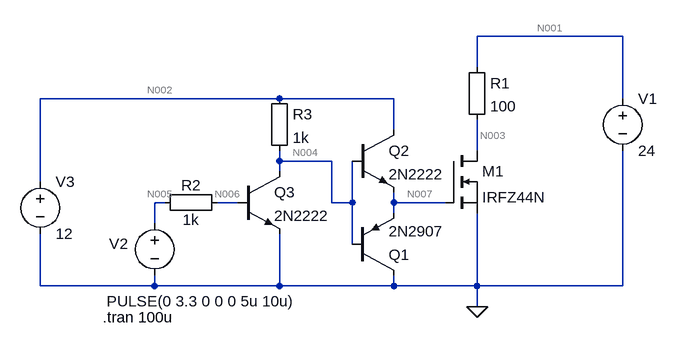
[diagram p0: schematic Drive3.asc]
Drive3.asc, the LTspice schematic file:
Version 4
SHEET 1 880 680
WIRE 464 -96 240 -96
WIRE 240 -48 240 -96
WIRE -64 0 -432 0
WIRE 112 0 -64 0
WIRE 464 0 464 -96
WIRE 112 48 112 0
WIRE 240 80 240 32
WIRE -64 96 -64 80
WIRE 16 96 -64 96
WIRE -64 112 -64 96
WIRE -432 128 -432 0
WIRE -240 160 -256 160
WIRE -128 160 -160 160
WIRE 16 160 16 96
WIRE 48 160 48 96
WIRE 48 160 16 160
WIRE 112 160 112 144
WIRE 192 160 112 160
WIRE 112 176 112 160
WIRE -256 192 -256 160
WIRE 48 224 48 160
WIRE -432 288 -432 208
WIRE -256 288 -256 272
WIRE -256 288 -432 288
WIRE -64 288 -64 208
WIRE -64 288 -256 288
WIRE 112 288 112 272
WIRE 112 288 -64 288
WIRE 240 288 240 176
WIRE 240 288 112 288
WIRE 464 288 464 80
WIRE 464 288 240 288
WIRE 240 320 240 288
FLAG 240 320 0
SYMBOL nmos 192 80 R0
SYMATTR InstName M1
SYMATTR Value IRFZ44N
SYMBOL voltage 464 -16 R0
WINDOW 123 0 0 Left 0
WINDOW 39 0 0 Left 0
SYMATTR InstName V1
SYMATTR Value 24
SYMBOL Misc\\EuropeanResistor 224 -64 R0
SYMATTR InstName R1
SYMATTR Value 100
SYMBOL Misc\\EuropeanResistor -256 176 R270
WINDOW 0 27 56 VTop 2
WINDOW 3 5 56 VBottom 2
SYMATTR InstName R2
SYMATTR Value 1k
SYMBOL voltage -256 176 R0
WINDOW 3 -74 136 Left 2
WINDOW 123 0 0 Left 0
WINDOW 39 0 0 Left 0
WINDOW 0 -70 47 Left 2
SYMATTR Value PULSE(0 3.3 0 0 0 5u 10u)
SYMATTR InstName V2
SYMBOL pnp 48 272 M180
SYMATTR InstName Q1
SYMATTR Value 2N2907
SYMBOL npn 48 48 R0
SYMATTR InstName Q2
SYMATTR Value 2N2222
SYMBOL voltage -432 112 R0
WINDOW 123 0 0 Left 0
WINDOW 39 0 0 Left 0
SYMATTR InstName V3
SYMATTR Value 12
SYMBOL Misc\\EuropeanResistor -80 -16 R0
SYMATTR InstName R3
SYMATTR Value 1k
SYMBOL npn -128 112 R0
SYMATTR InstName Q3
SYMATTR Value 2N2222
TEXT -336 336 Left 2 !.tran 100u

The netlist it stands for:
* Drive3.asc
M1 N003 N007 0 0 IRFZ44N
V1 N001 0 24
R1 N001 N003 100
R2 N005 N006 1k
V2 N005 0 PULSE(0 3.3 0 0 0 5u 10u)
Q1 0 N004 N007 0 2N2907
Q2 N002 N004 N007 0 2N2222
V3 N002 0 12
R3 N002 N004 1k
Q3 N004 N006 0 0 2N2222
.model NPN NPN
.model PNP PNP
.lib standard.bjt
.model NMOS NMOS
.model PMOS PMOS
.lib standard.mos
.tran 100u
.backanno
.end

* Results of the author's LTspice run, read from the files saved beside the schematic
* Operating Point, zero values left out:
*   V(n003) = 2.778 mV
*   V(n007) = 12 V
*   V(n001) = 24 V
*   V(n004) = 12 V
*   V(n002) = 12 V
*   Ic(Q3) = 12.01 pA
*   Ib(Q3) = -12 pA
*   Ic(Q1) = -12.02 pA
*   Ib(Q1) = 12 pA
*   Id(M1) = 240 mA
*   Is(M1) = -240 mA
*   I(R3) = 24.01 pA
*   I(R2) = -12 pA
*   I(R1) = 240 mA
*   I(V3) = -24.02 pA
*   I(V2) = 12 pA
*   I(V1) = -240 mA
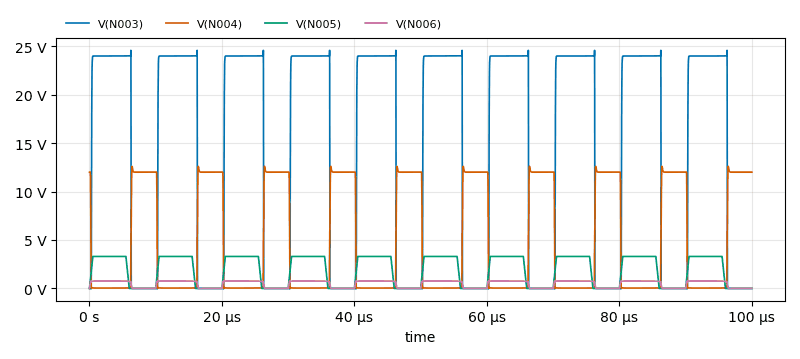
[diagram p1: Transient Analysis of Drive3.asc, plotted from the saved traces]
* Transient Analysis, 1 run:
*   V(N003): min -39.99 mV, max 24.58 V, average 14.28 V, rms 18.47 V, last 2.797 mV
*   V(N004): min 19.98 mV, max 12.61 V, average 4.739 V, rms 7.488 V, last 12 V
*   V(N005): min 0 V, max 3.3 V, average 1.815 V, rms 2.411 V, last 0 V
*   V(N006): min -11.08 mV, max 764.2 mV, average 473 mV, rms 596.3 mV, last 0 V